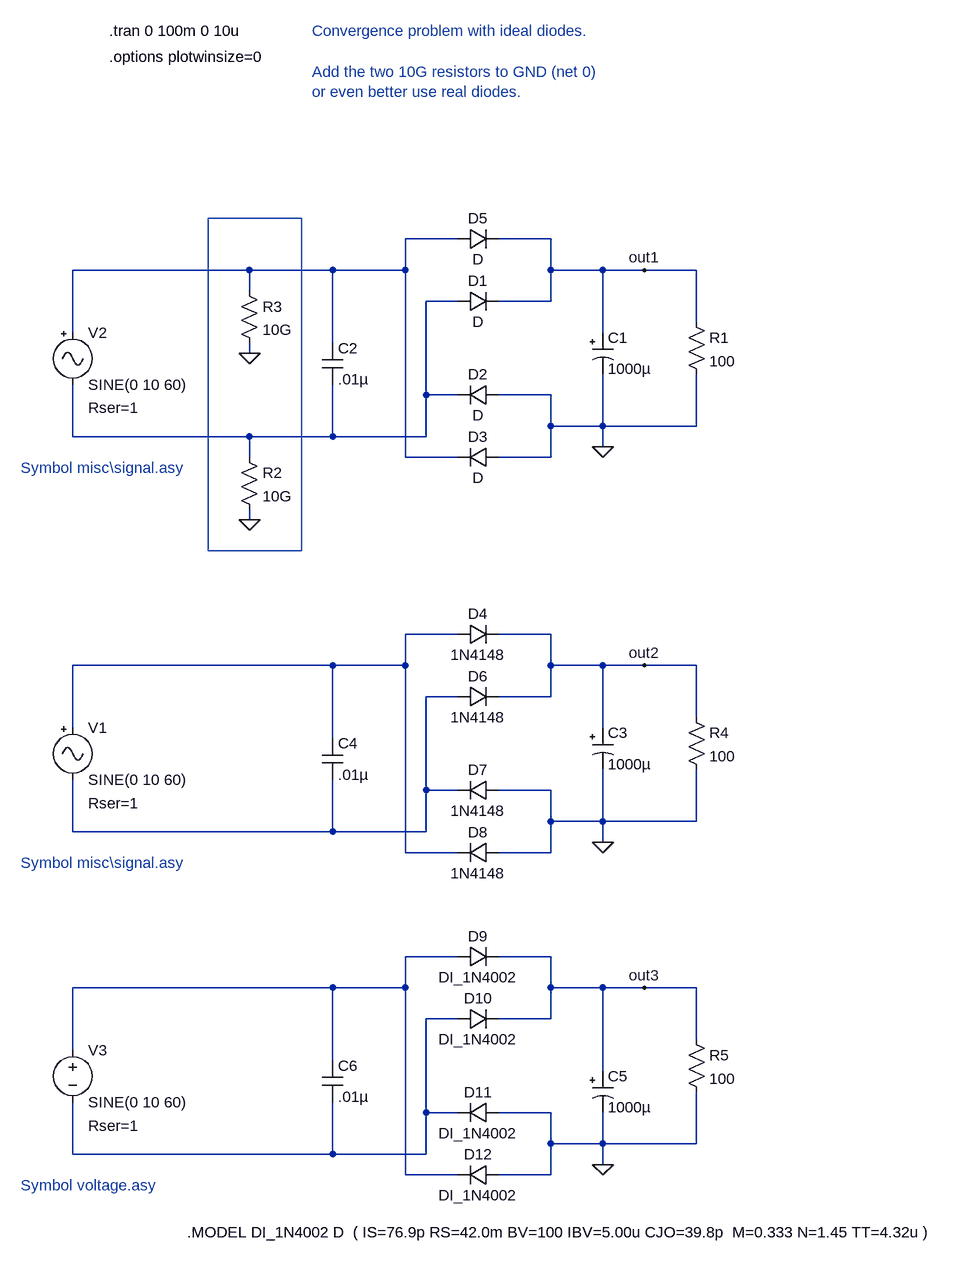
[diagram p0: schematic Bridge_Rectifier_Example1.asc]
Bridge_Rectifier_Example1.asc, the LTspice schematic file:
Version 4
SHEET 1 1036 1592
WIRE 128 48 48 48
WIRE 272 48 192 48
WIRE -192 96 -464 96
WIRE -64 96 -192 96
WIRE 48 96 48 48
WIRE 48 96 -64 96
WIRE 272 96 272 48
WIRE 352 96 272 96
WIRE 416 96 352 96
WIRE 496 96 416 96
WIRE -192 128 -192 96
WIRE 128 144 80 144
WIRE 272 144 272 96
WIRE 272 144 192 144
WIRE 496 176 496 96
WIRE -464 192 -464 96
WIRE 352 192 352 96
WIRE -64 208 -64 96
WIRE -192 224 -192 208
WIRE 80 288 80 144
WIRE 128 288 80 288
WIRE 272 288 192 288
WIRE 272 336 272 288
WIRE 352 336 352 256
WIRE 352 336 272 336
WIRE 496 336 496 256
WIRE 496 336 352 336
WIRE -464 352 -464 272
WIRE -192 352 -464 352
WIRE -64 352 -64 272
WIRE -64 352 -192 352
WIRE 80 352 80 288
WIRE 80 352 -64 352
WIRE 352 368 352 336
WIRE -192 384 -192 352
WIRE 48 384 48 96
WIRE 128 384 48 384
WIRE 272 384 272 336
WIRE 272 384 192 384
WIRE -192 480 -192 464
WIRE 128 656 48 656
WIRE 272 656 192 656
WIRE -64 704 -464 704
WIRE 48 704 48 656
WIRE 48 704 -64 704
WIRE 272 704 272 656
WIRE 352 704 272 704
WIRE 416 704 352 704
WIRE 496 704 416 704
WIRE 128 752 80 752
WIRE 272 752 272 704
WIRE 272 752 192 752
WIRE 496 784 496 704
WIRE -464 800 -464 704
WIRE 352 800 352 704
WIRE -64 816 -64 704
WIRE 80 896 80 752
WIRE 128 896 80 896
WIRE 272 896 192 896
WIRE 272 944 272 896
WIRE 352 944 352 864
WIRE 352 944 272 944
WIRE 496 944 496 864
WIRE 496 944 352 944
WIRE -464 960 -464 880
WIRE -64 960 -64 880
WIRE -64 960 -464 960
WIRE 80 960 80 896
WIRE 80 960 -64 960
WIRE 352 976 352 944
WIRE 48 992 48 704
WIRE 128 992 48 992
WIRE 272 992 272 944
WIRE 272 992 192 992
WIRE 128 1152 48 1152
WIRE 272 1152 192 1152
WIRE -64 1200 -464 1200
WIRE 48 1200 48 1152
WIRE 48 1200 -64 1200
WIRE 272 1200 272 1152
WIRE 352 1200 272 1200
WIRE 416 1200 352 1200
WIRE 496 1200 416 1200
WIRE 128 1248 80 1248
WIRE 272 1248 272 1200
WIRE 272 1248 192 1248
WIRE 496 1280 496 1200
WIRE -464 1296 -464 1200
WIRE -64 1312 -64 1200
WIRE 352 1328 352 1200
WIRE 80 1392 80 1248
WIRE 128 1392 80 1392
WIRE 272 1392 192 1392
WIRE 272 1440 272 1392
WIRE 352 1440 352 1392
WIRE 352 1440 272 1440
WIRE 496 1440 496 1360
WIRE 496 1440 352 1440
WIRE -464 1456 -464 1376
WIRE -64 1456 -64 1376
WIRE -64 1456 -464 1456
WIRE 80 1456 80 1392
WIRE 80 1456 -64 1456
WIRE 352 1472 352 1440
WIRE 48 1488 48 1200
WIRE 128 1488 48 1488
WIRE 272 1488 272 1440
WIRE 272 1488 192 1488
FLAG 352 368 0
FLAG -192 480 0
FLAG -192 224 0
FLAG 352 976 0
FLAG 416 96 out1
FLAG 416 704 out2
FLAG 352 1472 0
FLAG 416 1200 out3
SYMBOL Misc\\signal -464 176 R0
WINDOW 123 0 0 Left 0
WINDOW 39 24 132 Left 0
SYMATTR SpiceLine Rser=1
SYMATTR InstName V2
SYMATTR Value SINE(0 10 60)
SYMBOL polcap 336 192 R0
SYMATTR InstName C1
SYMATTR Value 1000µ
SYMATTR SpiceLine Rser=.01
SYMBOL res 480 160 R0
SYMATTR InstName R1
SYMATTR Value 100
SYMBOL cap -80 208 R0
SYMATTR InstName C2
SYMATTR Value .01µ
SYMBOL res -208 368 R0
SYMATTR InstName R2
SYMATTR Value 10G
SYMBOL diode 128 64 R270
WINDOW 0 32 32 VTop 0
WINDOW 3 0 32 VBottom 0
SYMATTR InstName D5
SYMBOL diode 128 160 R270
WINDOW 0 32 32 VTop 0
WINDOW 3 0 32 VBottom 0
SYMATTR InstName D1
SYMBOL diode 192 272 R90
WINDOW 0 0 32 VBottom 0
WINDOW 3 32 32 VTop 0
SYMATTR InstName D2
SYMBOL diode 192 368 R90
WINDOW 0 0 32 VBottom 0
WINDOW 3 32 32 VTop 0
SYMATTR InstName D3
SYMBOL res -208 112 R0
SYMATTR InstName R3
SYMATTR Value 10G
SYMBOL Misc\\signal -464 784 R0
WINDOW 123 0 0 Left 0
WINDOW 39 24 132 Left 0
SYMATTR SpiceLine Rser=1
SYMATTR InstName V1
SYMATTR Value SINE(0 10 60)
SYMBOL polcap 336 800 R0
SYMATTR InstName C3
SYMATTR Value 1000µ
SYMATTR SpiceLine Rser=.01
SYMBOL res 480 768 R0
SYMATTR InstName R4
SYMATTR Value 100
SYMBOL cap -80 816 R0
SYMATTR InstName C4
SYMATTR Value .01µ
SYMBOL diode 128 672 R270
WINDOW 0 32 32 VTop 0
WINDOW 3 0 32 VBottom 0
SYMATTR InstName D4
SYMATTR Value 1N4148
SYMBOL diode 128 768 R270
WINDOW 0 32 32 VTop 0
WINDOW 3 0 32 VBottom 0
SYMATTR InstName D6
SYMATTR Value 1N4148
SYMBOL diode 192 880 R90
WINDOW 0 0 32 VBottom 0
WINDOW 3 32 32 VTop 0
SYMATTR InstName D7
SYMATTR Value 1N4148
SYMBOL diode 192 976 R90
WINDOW 0 0 32 VBottom 0
WINDOW 3 32 32 VTop 0
SYMATTR InstName D8
SYMATTR Value 1N4148
SYMBOL polcap 336 1328 R0
SYMATTR InstName C5
SYMATTR Value 1000µ
SYMATTR SpiceLine Rser=.01
SYMBOL res 480 1264 R0
SYMATTR InstName R5
SYMATTR Value 100
SYMBOL cap -80 1312 R0
SYMATTR InstName C6
SYMATTR Value .01µ
SYMBOL diode 128 1168 R270
WINDOW 0 32 32 VTop 0
WINDOW 3 0 32 VBottom 0
SYMATTR InstName D9
SYMATTR Value DI_1N4002
SYMBOL diode 128 1264 R270
WINDOW 0 32 32 VTop 0
WINDOW 3 0 32 VBottom 0
SYMATTR InstName D10
SYMATTR Value DI_1N4002
SYMBOL diode 192 1376 R90
WINDOW 0 0 32 VBottom 0
WINDOW 3 32 32 VTop 0
SYMATTR InstName D11
SYMATTR Value DI_1N4002
SYMBOL diode 192 1472 R90
WINDOW 0 0 32 VBottom 0
WINDOW 3 32 32 VTop 0
SYMATTR InstName D12
SYMATTR Value DI_1N4002
SYMBOL voltage -464 1280 R0
WINDOW 123 0 0 Left 0
WINDOW 39 24 132 Left 0
SYMATTR InstName V3
SYMATTR Value SINE(0 10 60)
SYMATTR SpiceLine Rser=1
TEXT -408 -272 Left 0 !.tran 0 100m 0 10u
TEXT -96 -272 Left 0 ;Convergence problem with ideal diodes.\n \nAdd the two 10G resistors to GND (net 0) \nor even better use real diodes.
TEXT -408 -232 Left 0 !.options plotwinsize=0
TEXT -544 400 Left 0 ;Symbol misc\\signal.asy
TEXT -544 1008 Left 0 ;Symbol misc\\signal.asy
TEXT -544 1504 Left 0 ;Symbol voltage.asy
TEXT -288 1576 Left 0 !.MODEL DI_1N4002 D  ( IS=76.9p RS=42.0m BV=100 IBV=5.00u CJO=39.8p  M=0.333 N=1.45 TT=4.32u )
RECTANGLE Normal -112 528 -256 16

The netlist it stands for:
* Bridge_Rectifier_Example1.asc
V2 N001 N002 SINE(0 10 60) Rser=1
C1 out1 0 1000µ Rser=.01
R1 out1 0 100
C2 N001 N002 .01µ
R2 N002 0 10G
D5 N001 out1 D
D1 N002 out1 D
D2 0 N002 D
D3 0 N001 D
R3 N001 0 10G
V1 N003 N004 SINE(0 10 60) Rser=1
C3 out2 0 1000µ Rser=.01
R4 out2 0 100
C4 N003 N004 .01µ
D4 N003 out2 1N4148
D6 N004 out2 1N4148
D7 0 N004 1N4148
D8 0 N003 1N4148
C5 out3 0 1000µ Rser=.01
R5 out3 0 100
C6 N005 N006 .01µ
D9 N005 out3 DI_1N4002
D10 N006 out3 DI_1N4002
D11 0 N006 DI_1N4002
D12 0 N005 DI_1N4002
V3 N005 N006 SINE(0 10 60) Rser=1
.model D D
.lib standard.dio
.tran 0 100m 0 10u
* Convergence problem with ideal diodes.
* Add the two 10G resistors to GND (net 0)
* or even better use real diodes.
.options plotwinsize=0
* Symbol misc\signal.asy
* Symbol misc\signal.asy
* Symbol voltage.asy
.MODEL DI_1N4002 D  ( IS=76.9p RS=42.0m BV=100 IBV=5.00u CJO=39.8p  M=0.333 N=1.45 TT=4.32u )
.backanno
.end